# EasyEDA schematic Pulgarcito_2.json
TITLE: Sheet_1; REV: 1.0; Date: 2019-10-03; Sheet: 1/1; Drawn By: nessmp; Company: Your Company
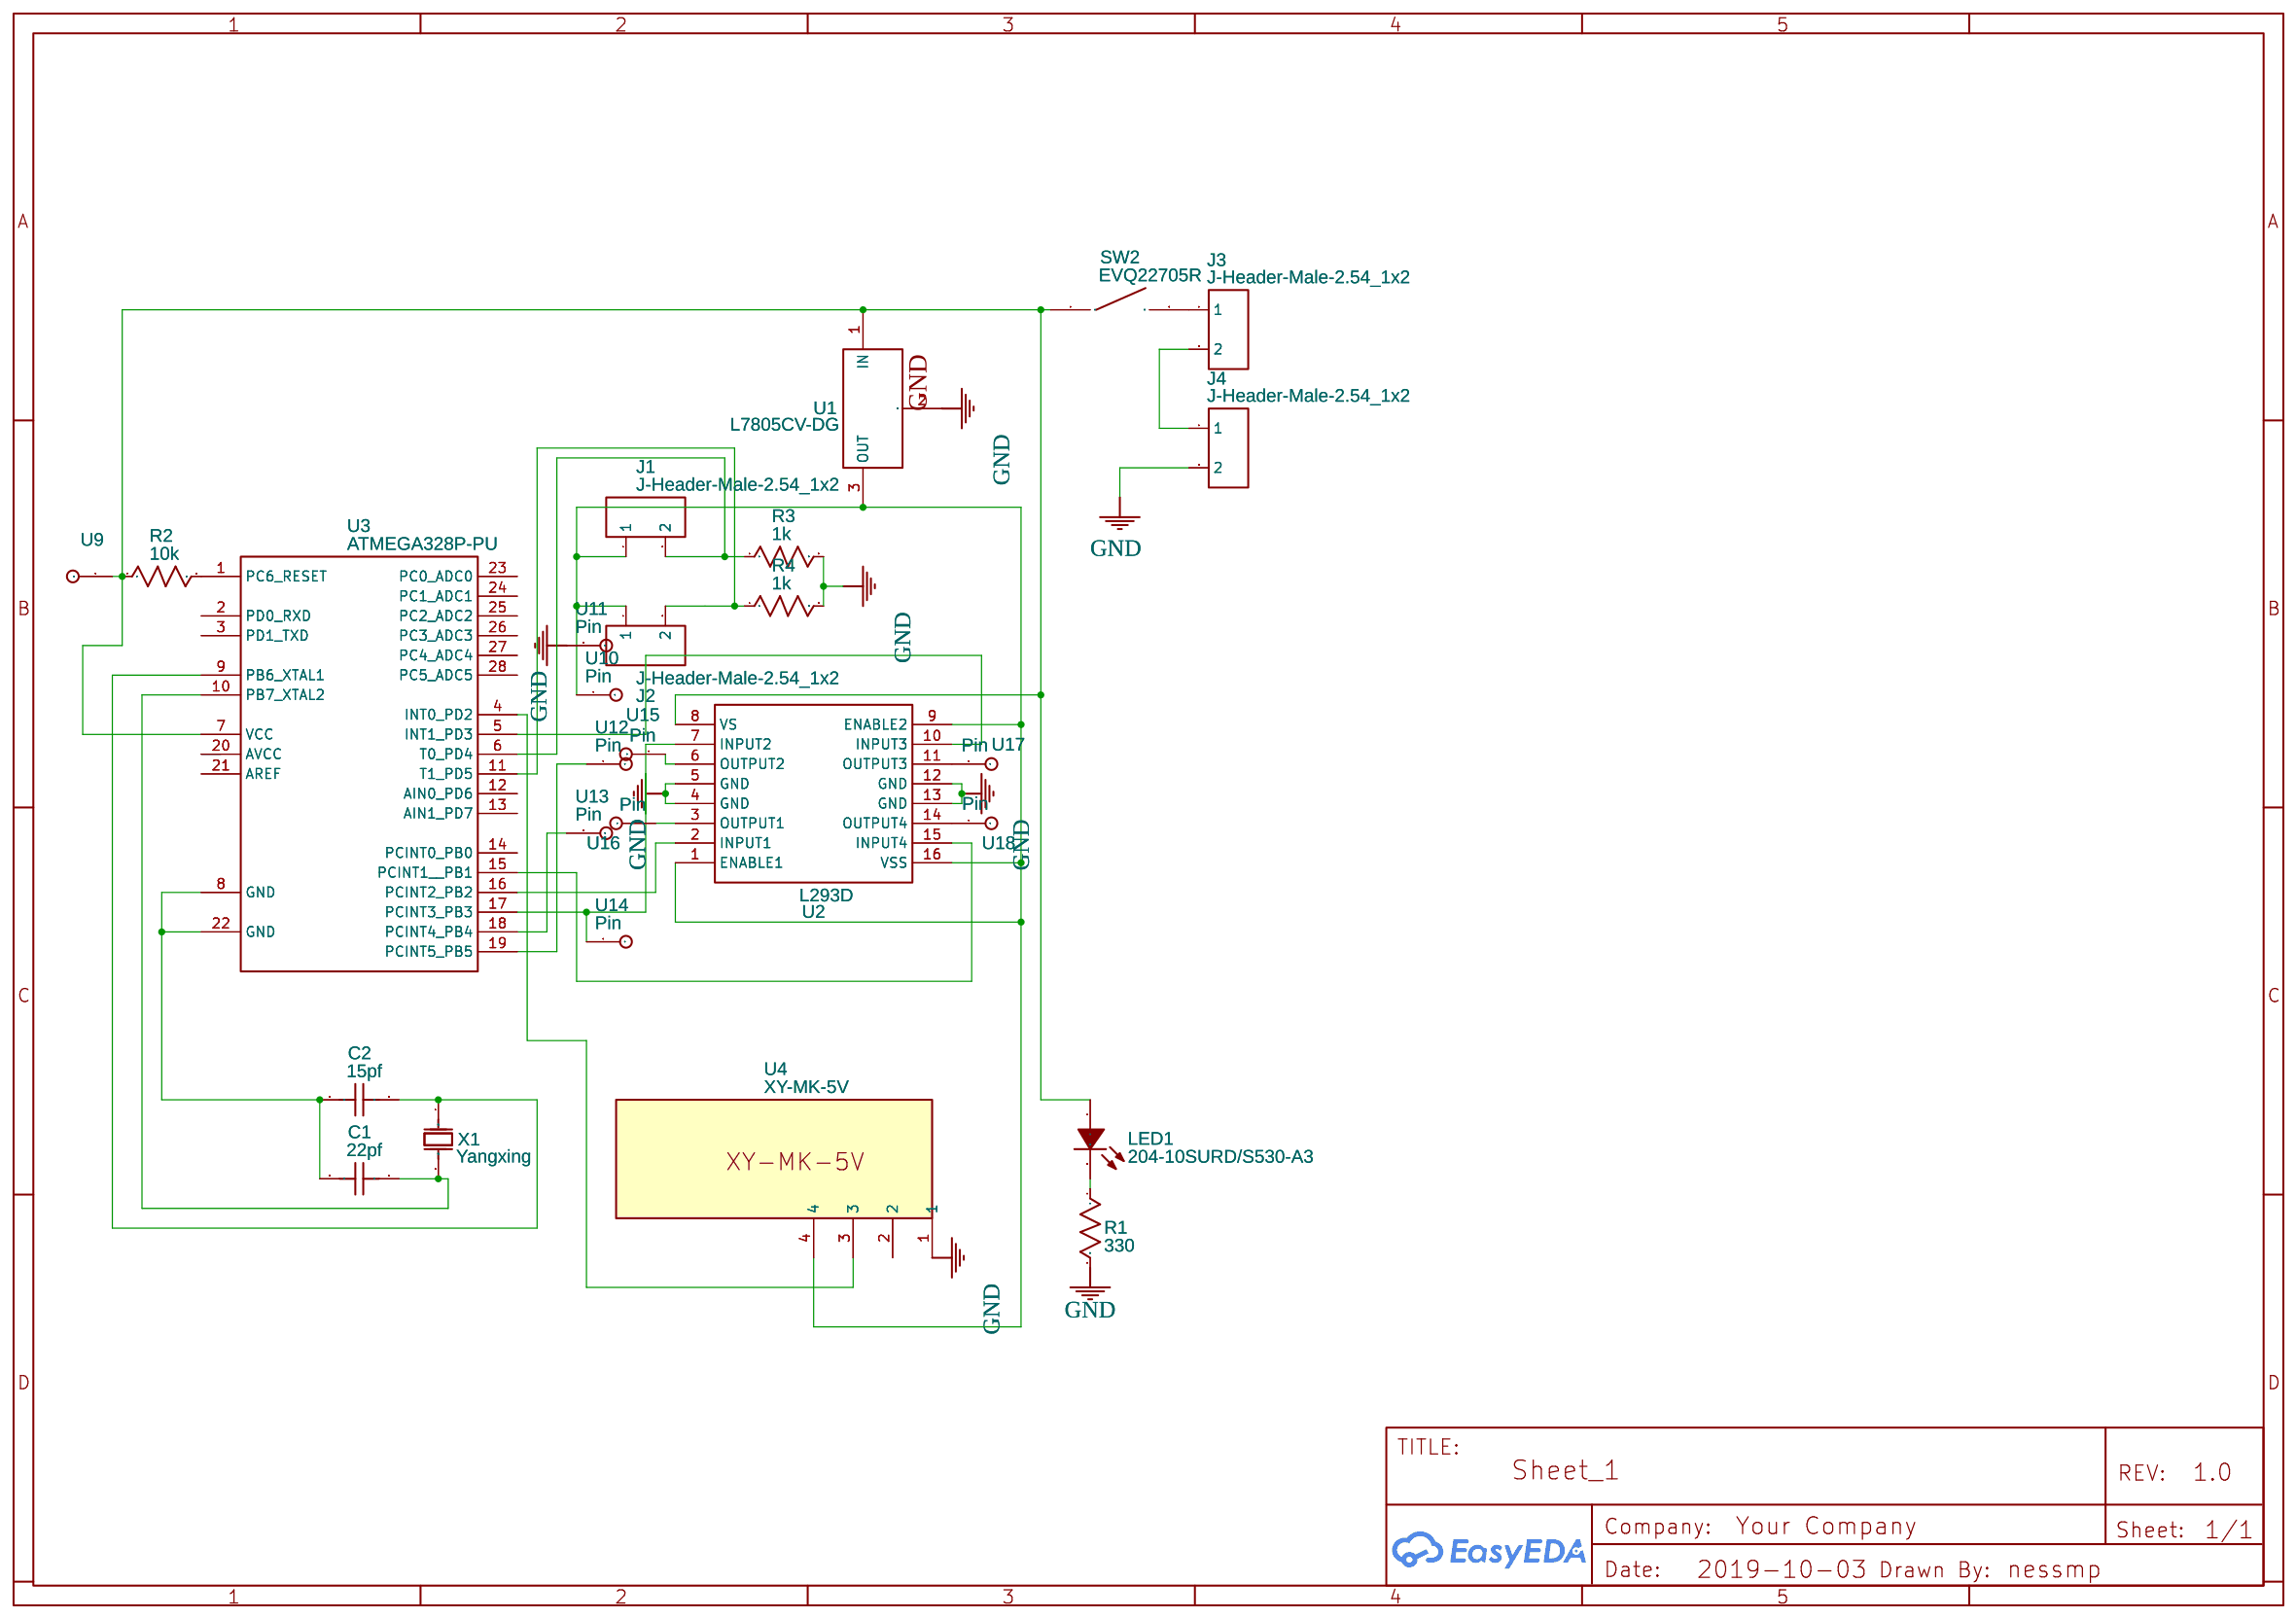
[diagram p0: schematic sheet]

## Parts
C1  22pf  [RAD-0.1]
C2  15pf  [RAD-0.1]
J1  J-Header-Male-2.54_1x2  [HDR-2X1/2.54]
J2  J-Header-Male-2.54_1x2  [HDR-2X1/2.54]
J3  J-Header-Male-2.54_1x2  [HDR-2X1/2.54]
J4  J-Header-Male-2.54_1x2  [HDR-2X1/2.54]
LED1  204-10SURD/S530-A3  [LED-3MM/2.54]
R1  330  [AXIAL-0.3]
R2  10k  [AXIAL-0.3]
R3  1k  [AXIAL-0.3]
R4  1k  [AXIAL-0.3]
SW2  EVQ22705R  [KEY-6.0*6.0-4]
U1  L7805CV-DG  [TO-220(TO-220-3)]
U2  L293D  [DIP-16]
U3  ATMEGA328P-PU  [DIP-28_L34.6-W7.3-P2.54-LS10.2-BL]
U4  XY-MK-5V  [PIN_HEADER_STRAIGHT_1X04_PITCH2.54MM]
U9  Pin  [PIN_HEADER_STRAIGHT_1X01_PITCH2.54MM]
U10  Pin  [PIN_HEADER_STRAIGHT_1X01_PITCH2.54MM]
U11  Pin  [PIN_HEADER_STRAIGHT_1X01_PITCH2.54MM]
U12  Pin  [PIN_HEADER_STRAIGHT_1X01_PITCH2.54MM]
U13  Pin  [PIN_HEADER_STRAIGHT_1X01_PITCH2.54MM]
U14  Pin  [PIN_HEADER_STRAIGHT_1X01_PITCH2.54MM]
U15  Pin  [PIN_HEADER_STRAIGHT_1X01_PITCH2.54MM]
U16  Pin  [PIN_HEADER_STRAIGHT_1X01_PITCH2.54MM]
U17  Pin  [PIN_HEADER_STRAIGHT_1X01_PITCH2.54MM]
U18  Pin  [PIN_HEADER_STRAIGHT_1X01_PITCH2.54MM]
X1  Yangxing  [HC-49US_L11.5-W4.5-P4.88]

## Library data of the parts
C1 C2 = Cap_RAD-0.1_US
J1-J4 = -: Supplier Part: C86471; Supplier: LCSC; Manufacturer: TE Connectivity; Manufacturer Part: 826629-2; image: //image.lceda.cn/szlcsc/C86471.jpg; link: //image.lceda.cn/szlcsc/C86471.jpg
LED1 = -: Supplier: LCSC; Manufacturer: EVERLIGHT; Supplier Part: C99772
R1-R4 = Res_AXIAL-0.3(1/8W)_US
SW2 = -: Supplier: LCSC; Manufacturer: PANASONIC; Contributor: LCSC; Supplier Part: C79156
U1 = -: Supplier: LCSC; Manufacturer: STMicroelectronics; Manufacturer Part: L7806CV-DG; image: //image.lceda.cn/szlcsc/C3796.jpg; Supplier Part: C3796
U2 = -: Contributor: pitreluc; Supplier: LCSC; Manufacturer: STMicroelectronics; image: //image.lceda.cn/szlcsc/C12340.jpg; Supplier Part: C12340
U3 = -: sourceId: Oic6oiASL; Supplier: LCSC; Manufacturer: MICROCHIP; image: //image.lceda.cn/szlcsc/C33901.jpg; Contributor: LCSC; Supplier Part: C33901
U4 = -: Contributor: Алексей Кажарский
U9-U18 = -: Contributor: OpvS0OU3iRgTi1deEJgjG
X1 = 25MHz 49S: Supplier: LCSC; Supplier Part: C12886; Manufacturer: Yangxing Tech; Contributor: LCSC

## Nets
GND: J4.2 R1.2 R3.2 R4.2 U1.2(GND) U2.4(GND) U2.5(GND) U2.12(GND) U2.13(GND) U4.1 U11.1
Net-(C1-1): C1.1 U3.10(PB7 XTAL2) X1.2(OSC2)
Net-(C1-2): C1.2 C2.2 U3.8(GND) U3.22(GND)
Net-(C2-1): C2.1 U3.9(PB6 XTAL1) X1.1(OSC1)
Net-(J1-1): J1.1 J2.1 U1.3(OUT) U2.1(ENABLE1) U2.9(ENABLE2) U2.16(VSS) U4.4 U10.1
Net-(J1-2): J1.2 R3.1 U3.6(T0 PD4)
Net-(J2-2): J2.2 R4.1 U3.11(T1 PD5)
Net-(J3-1): J3.1 SW2.2
Net-(J3-2): J3.2 J4.1
Net-(LED1-1): LED1.1(A) R2.1 SW2.1 U1.1(IN) U2.8(VS) U3.7(VCC) U9.1
Net-(LED1-2): LED1.2(K) R1.1
Net-(R2-2): R2.2 U3.1(PC6 RESET)
Net-(U2-2): U2.2(INPUT1) U3.16(PCINT2 PB2)
Net-(U2-3): U2.3(OUTPUT1) U16.1
Net-(U2-6): U2.6(OUTPUT2) U15.1
Net-(U2-7): U2.7(INPUT2) U3.17(PCINT3 PB3) U14.1
Net-(U2-10): U2.10(INPUT3) U3.5(INT1 PD3)
Net-(U2-11): U2.11(OUTPUT3) U17.1
Net-(U2-14): U2.14(OUTPUT4) U18.1
Net-(U2-15): U2.15(INPUT4) U3.15(PCINT1  PB1)
Net-(U3-4): U3.4(INT0 PD2) U4.3
Net-(U3-18): U3.18(PCINT4 PB4) U13.1
Net-(U3-19): U3.19(PCINT5 PB5) U12.1

Not connected (* = marked no-connect by the designer): U3 2(PD0 RXD) 3(PD1 TXD) 12(AIN0 PD6) 13(AIN1 PD7) 14(PCINT0 PB0) 20(AVCC) 21(AREF) 23(PC0 ADC0) 24(PC1 ADC1) 25(PC2 ADC2) 26(PC3 ADC3) 27(PC4 ADC4) 28(PC5 ADC5); U4 2
